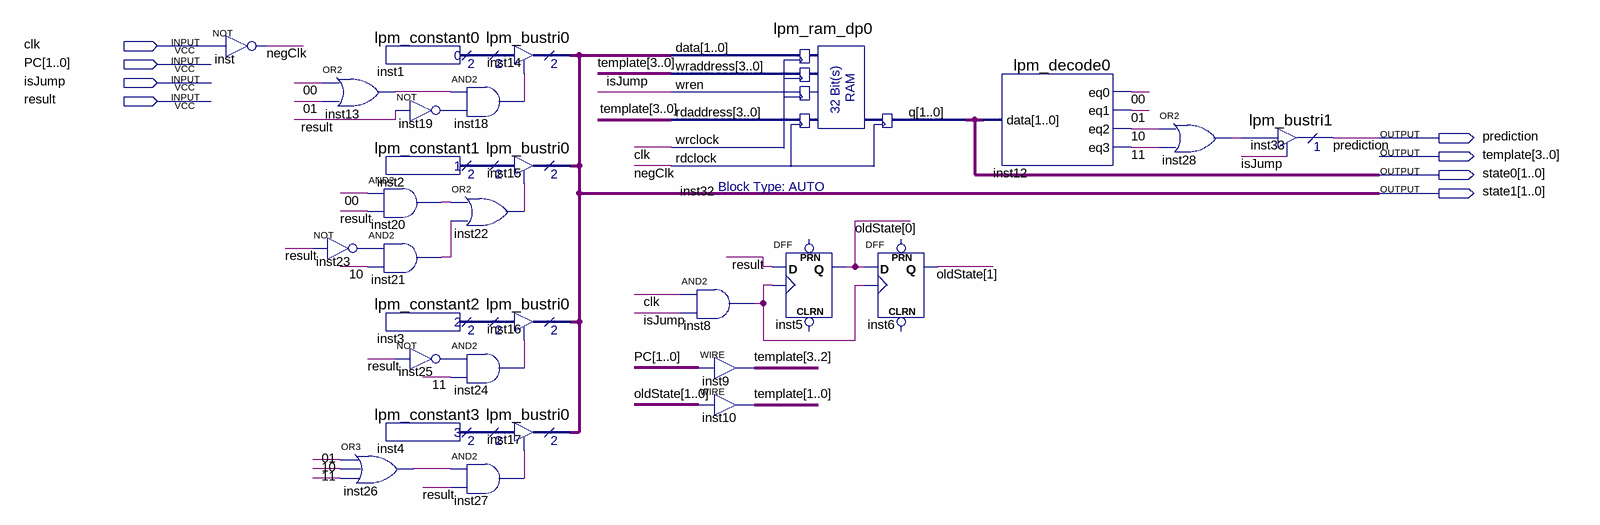
[diagram p0: schematic sheet]
// Quartus schematic LabProject8.bdf as structural Verilog: 29 symbols, 8 pins
module LabProject8 (
  input  clk,
  input  [1:0] PC,
  input  isJump,
  input  result,
  output prediction,
  output [3:0] template,
  output [1:0] state0,
  output [1:0] state1
);

  wire \00 , \01 , \10 , \11 , inst8_out, inst13_out, inst18_out, inst19_out, inst20_out, inst21_out,
       inst22_out, inst23_out, inst24_out, inst25_out, inst26_out, inst27_out, inst28_out, negClk;
  wire [1:0] inst1_result, inst2_result, inst3_result, inst4_result, oldState;

  not inst (negClk, clk);
  or inst13 (inst13_out, \00 , \01 );
  not inst23 (inst23_out, result);
  or inst26 (inst26_out, \01 , \10 , \11 );
  lpm_constant0 inst1 (.result(inst1_result));
  not inst19 (inst19_out, result);
  lpm_constant1 inst2 (.result(inst2_result));
  and inst20 (inst20_out, \00 , result);
  and inst21 (inst21_out, inst23_out, \10 );
  lpm_constant2 inst3 (.result(inst3_result));
  not inst25 (inst25_out, result);
  lpm_constant3 inst4 (.result(inst4_result));
  lpm_bustri0 inst14 (.enabledt(inst18_out), .data(inst1_result), .tridata(state1));
  and inst18 (inst18_out, inst13_out, inst19_out);
  lpm_bustri0 inst15 (.enabledt(inst22_out), .data(inst2_result), .tridata(state1));
  or inst22 (inst22_out, inst20_out, inst21_out);
  lpm_bustri0 inst16 (.enabledt(inst24_out), .data(inst3_result), .tridata(state1));
  and inst24 (inst24_out, inst25_out, \11 );
  lpm_bustri0 inst17 (.enabledt(inst27_out), .data(inst4_result), .tridata(state1));
  and inst27 (inst27_out, inst26_out, result);
  lpm_ram_dp0 inst32 (
    .data(state1), .wraddress(template), .wren(isJump), .rdaddress(template), .wrclock(clk),
    .rdclock(negClk), .q(state0));
  and inst8 (inst8_out, clk, isJump);
  assign template[3:2] = PC;  // WIRE inst9
  assign template[1:0] = oldState;  // WIRE inst10
  DFF inst5 (.CLK(inst8_out), .D(result), .Q(oldState[0]));  // open: CLRN, PRN
  DFF inst6 (.CLK(inst8_out), .D(oldState[0]), .Q(oldState[1]));  // open: CLRN, PRN
  lpm_decode0 inst12 (.data(state0), .eq0(\00 ), .eq1(\01 ), .eq2(\10 ), .eq3(\11 ));
  or inst28 (inst28_out, \10 , \11 );
  lpm_bustri1 inst33 (.enabledt(isJump), .data(inst28_out), .tridata(prediction));
endmodule
